# EAGLE design TRI STATE BUFFER (EAGLE 9.2.2)
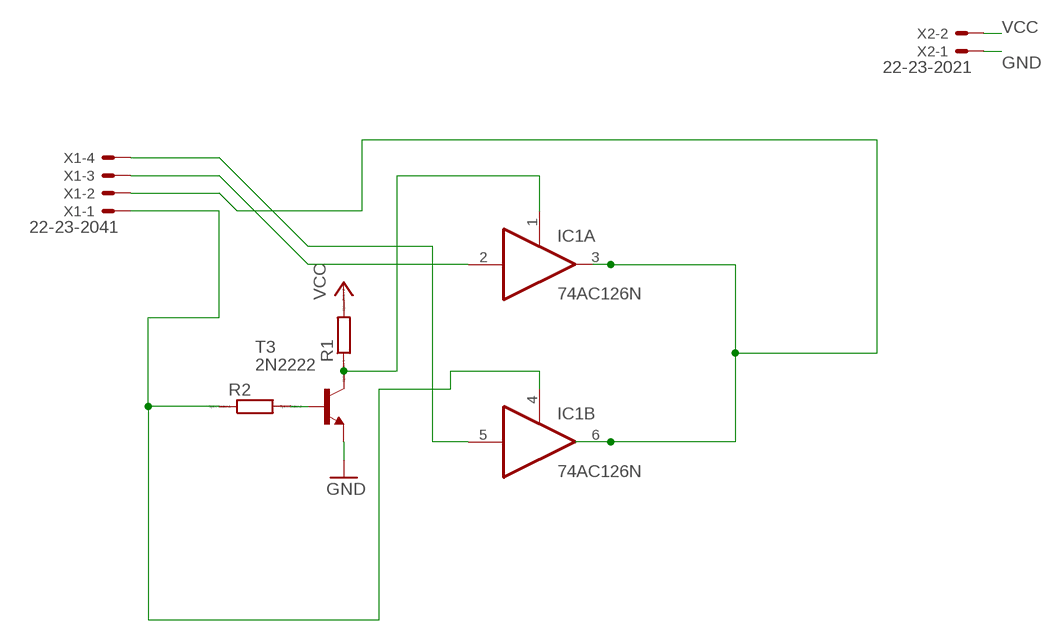
[diagram p0: schematic, sheet 1]

## Parts
IC1  74AC126N  [DIL14]
R1  R0204/7  [0204/7]
R2  R0204/7  [0204/7]
T3  2N2222  [TO92-EBC-OVAL]
X1  22-23-2041  [22-23-2041]
X2  22-23-2021  [22-23-2021]

## Nets
GND: T3.E X2.1
N$3: IC1.1(A:OE) R1.1 T3.C
N$4: IC1.4(B:OE) R2.1 X1.1
N$5: IC1.3(A:O) IC1.6(B:O) X1.2
N$7: IC1.5(B:I) X1.4
N$8: IC1.2(A:I) X1.3
N$9: R2.2 T3.B
VCC: R1.2 X2.2
Unconnected: IC1.8(C:O) IC1.9(C:I) IC1.10(C:OE) IC1.11(D:O) IC1.12(D:I) IC1.13(D:OE)

## Power pins joined to a net without a drawn wire
GND: IC1.7(P:GND)
VCC: IC1.14(P:VCC)

## Library data of the parts
IC1 = 74xx-eu:74*126: Quad bus BUFFER, 3-state
R1 R2 = eagle-ltspice:R: RESISTOR, European symbol; SPICEMODEL: NONE; SPICEPREFIX: R
T3 = adafruit:2N2222: NPN TRANSISTOR Big oval pads
X1 = con-molex:22-23-2041: .100" (2.54mm) Center Header - 4 Pin; MF: MOLEX; MPN: 22-23-2041; OC_FARNELL: 1462920; OC_NEWARK: 38C0355
X2 = con-molex:22-23-2021: .100" (2.54mm) Center Header - 2 Pin; MF: MOLEX; MPN: 22-23-2021; OC_FARNELL: 1462926; OC_NEWARK: 25C3832

## Board
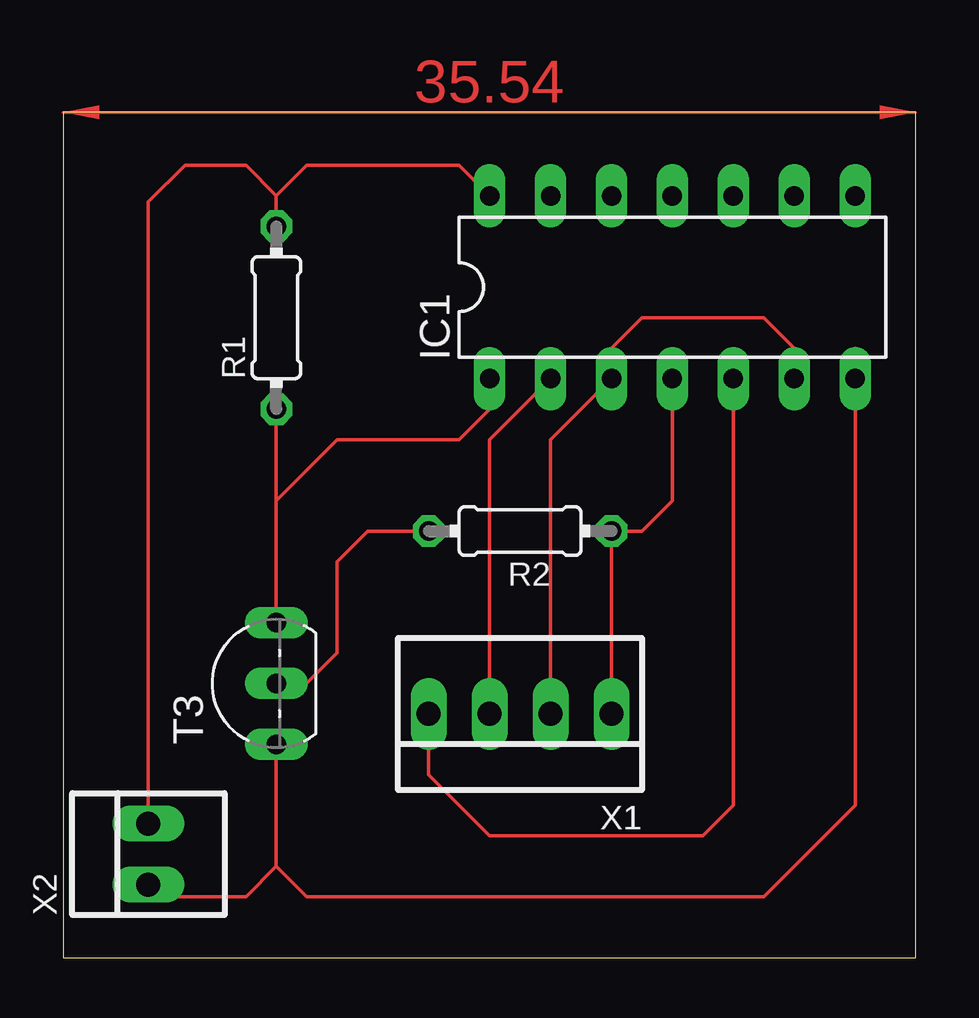
[diagram p1: board, top side]

Size 35.54 x 35.23 mm. Coordinates in mm from the lower left corner, seen from the top.
Outline: 0,0 35.54,0 35.54,35.23 0,35.23 0,0
Copper layers (1*16): Top 0.035mm / dielectric 1.5mm / Bottom 0.035mm
Design rules "default": minimum track width 6mil, minimum drill 0.35mm, track to track 6mil, track to pad 6mil, pad to pad 6mil, via to via 6mil, smd to smd 6mil, copper to edge 40mil, drill to drill 6mil, minimum pad ring 10mil, minimum via ring 8mil, stop-mask expansion 4mil, vias tented up to drill 0mil, thermal gap 10mil

### Footprints (pad centres in the part's own frame; a part is rotated, then mirrored left to right if it is on the bottom)
DIL14 = drill 0.813 long: 1 -7.62,-3.81; 2 -5.08,-3.81; 3 -2.54,-3.81; 4 0,-3.81; 5 2.54,-3.81; 6 5.08,-3.81; 7 7.62,-3.81; 8 7.62,3.81; 9 5.08,3.81; 10 2.54,3.81; 11 0,3.81; 12 -2.54,3.81; 13 -5.08,3.81; 14 -7.62,3.81
0204/7 = drill 0.813 octagon: 1 -3.81,0; 2 3.81,0
TO92-EBC-OVAL = drill 0.813 long: B 0,-1.27; C 2.54,-1.27; E -2.54,-1.27
22-23-2041 = drill 1 long: 1 -3.81,0; 2 -1.27,0; 3 1.27,0; 4 3.81,0
22-23-2021 = drill 1 long: 1 -1.27,0; 2 1.27,0

### Placement (x,y rotation side)
IC1  25.4,27.94 0 top
R1  8.89,26.67 90 top
R2  19.05,17.78 180 top
T3  7.62,11.43 90 top
X1  19.05,10.16 180 top
X2  3.56,4.32 90 top

### Tracks (layer width: path | path; a pad name or v marks a point on that pad's centre or on a via)
GND
  Top 0.152: 33.02,25.4 IC1.7 33.02,6.35 29.21,2.54 10.16,2.54 8.89,3.81 | X2.1 4.06,2.54 7.62,2.54 8.89,3.81 | 8.89,3.81 T3.E
N$3
  Top 0.152: R1.1 8.89,19.05 | 8.89,19.05 T3.C | IC1.1 17.78,22.86 16.51,21.59 11.43,21.59 8.89,19.05
N$4
  Top 0.152: X1.1 R2.1 24.13,17.78 25.4,19.05 IC1.4
N$5
  Top 0.152: X1.2 20.32,21.59 IC1.3 22.86,25.4 24.13,26.67 29.21,26.67 30.48,25.4 IC1.6
N$7
  Top 0.152: X1.4 15.24,7.62 17.78,5.08 26.67,5.08 27.94,6.35 IC1.5
N$8
  Top 0.152: IC1.2 17.78,21.59 X1.3
N$9
  Top 0.152: T3.B 10.16,11.43 11.43,12.7 11.43,16.51 12.7,17.78 R2.2
VCC
  Top 0.152: R1.2 8.89,31.75 | X2.2 3.56,31.5 5.08,33.02 7.62,33.02 8.89,31.75 | 8.89,31.75 10.16,33.02 16.51,33.02 IC1.14
(copper drawn outside any net)
  shapes: Top area x1